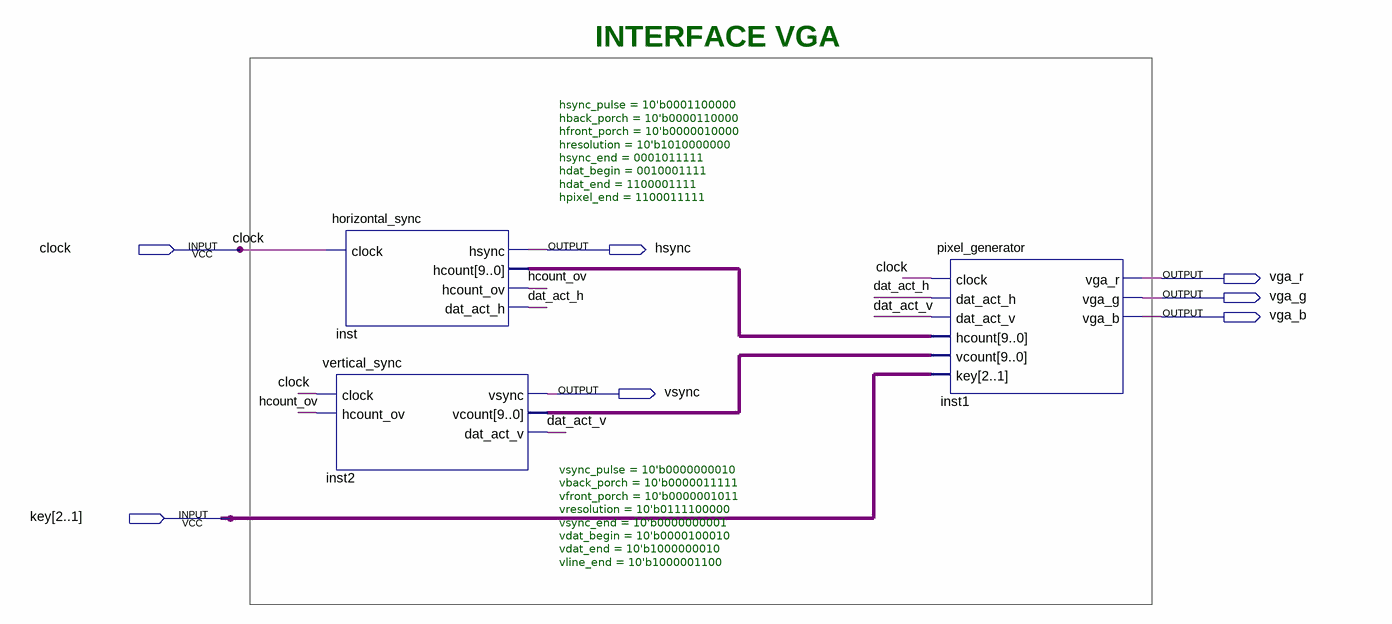
[diagram p0: schematic sheet]
// Quartus schematic vga_interface_topo.bdf as structural Verilog: 3 symbols, 7 pins
module vga_interface_topo (
  input  clock,
  input  [2:1] key,
  output hsync,
  output vga_r,
  output vga_g,
  output vga_b,
  output vsync
);

  wire dat_act_h, dat_act_v, hcount_ov;
  wire [9:0] inst2_vcount, inst_hcount;

  horizontal_sync #(.hsync_pulse(10'b0001100000), .hback_porch(10'b0000110000), .hfront_porch(10'b0000010000), .hresolution(10'b1010000000), .hsync_end(0001011111), .hdat_begin(0010001111), .hdat_end(1100001111), .hpixel_end(1100011111)) inst (
    .clock(clock), .hsync(hsync), .hcount(inst_hcount), .hcount_ov(hcount_ov), .dat_act_h(dat_act_h));
  vertical_sync #(.vsync_pulse(10'b0000000010), .vback_porch(10'b0000011111), .vfront_porch(10'b0000001011), .vresolution(10'b0111100000), .vsync_end(10'b0000000001), .vdat_begin(10'b0000100010), .vdat_end(10'b1000000010), .vline_end(10'b1000001100)) inst2 (
    .clock(clock), .hcount_ov(hcount_ov), .vsync(vsync), .vcount(inst2_vcount), .dat_act_v(dat_act_v));
  pixel_generator inst1 (
    .clock(clock), .dat_act_h(dat_act_h), .dat_act_v(dat_act_v), .hcount(inst_hcount), .vcount(inst2_vcount),
    .key(key), .vga_r(vga_r), .vga_g(vga_g), .vga_b(vga_b));

  // Notes on the sheet:
  //   INTERFACE VGA
endmodule
